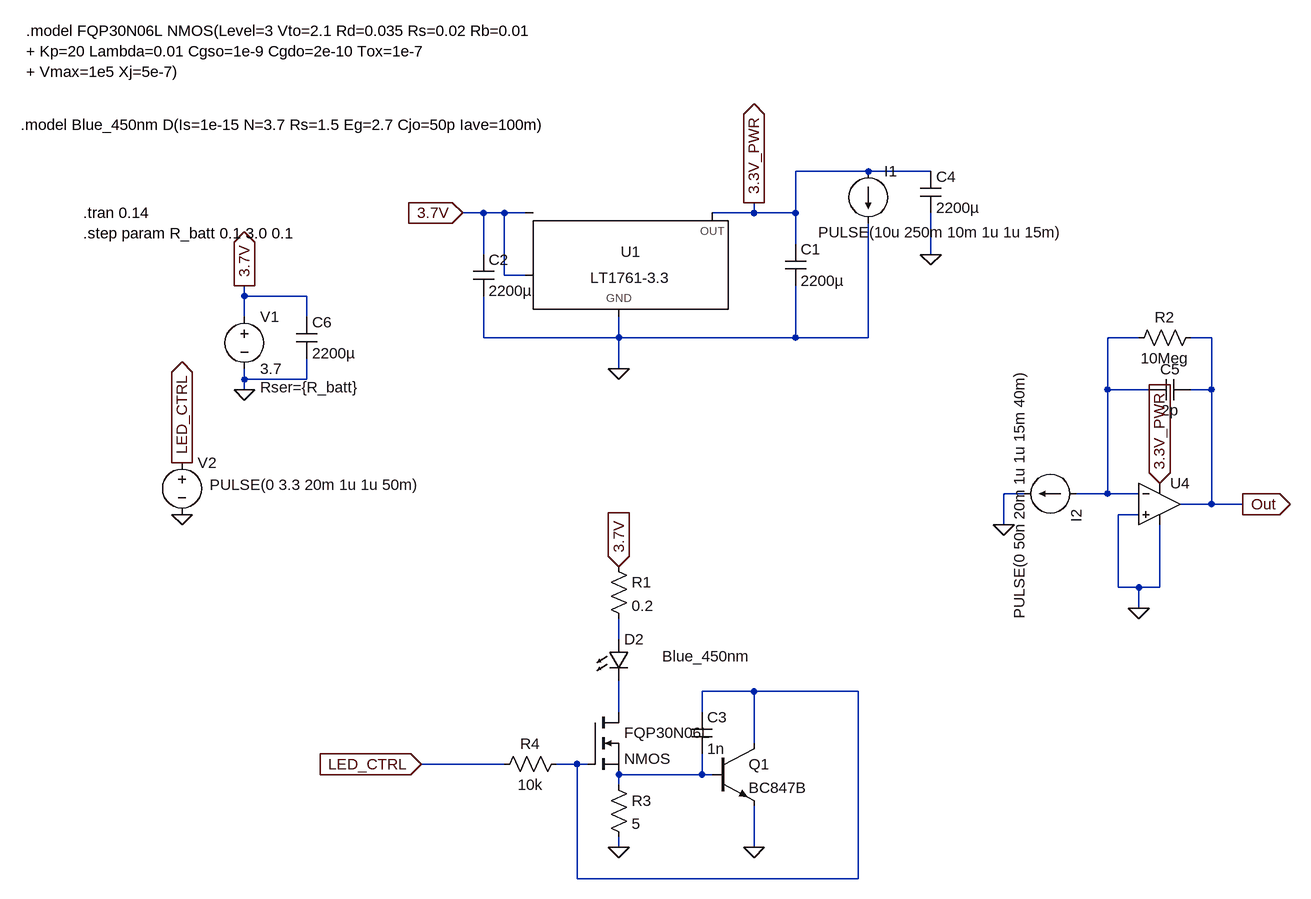
[diagram p0: schematic Draft Power Sim.asc]
Draft Power Sim.asc, the LTspice schematic file:
Version 4.1
SHEET 1 2488 964
WIRE 784 -128 672 -128
WIRE 880 -128 784 -128
WIRE 192 -64 160 -64
WIRE 224 -64 192 -64
WIRE 256 -64 224 -64
WIRE 608 -64 608 -80
WIRE 608 -64 544 -64
WIRE 672 -64 672 -128
WIRE 672 -64 608 -64
WIRE 672 -16 672 -64
WIRE 192 0 192 -64
WIRE 880 0 880 -64
WIRE 224 32 224 -64
WIRE 256 32 224 32
WIRE -176 64 -176 48
WIRE -80 64 -176 64
WIRE -176 96 -176 64
WIRE -80 96 -80 64
WIRE 192 128 192 64
WIRE 400 128 400 96
WIRE 400 128 192 128
WIRE 672 128 672 48
WIRE 672 128 400 128
WIRE 784 128 784 -48
WIRE 784 128 672 128
WIRE 1200 128 1152 128
WIRE 1312 128 1280 128
WIRE 400 176 400 128
WIRE -176 192 -176 176
WIRE -80 192 -80 160
WIRE -80 192 -176 192
WIRE -176 208 -176 192
WIRE 1152 208 1152 128
WIRE 1216 208 1152 208
WIRE 1312 208 1312 128
WIRE 1312 208 1280 208
WIRE 1024 368 992 368
WIRE 1152 368 1152 208
WIRE 1152 368 1104 368
WIRE 1200 368 1152 368
WIRE 1312 384 1312 208
WIRE 1312 384 1264 384
WIRE 1360 384 1312 384
WIRE 1200 400 1168 400
WIRE 992 416 992 368
WIRE 1168 512 1168 400
WIRE 1200 512 1168 512
WIRE 1232 512 1232 416
WIRE 1232 512 1200 512
WIRE 1200 544 1200 512
WIRE 400 592 400 560
WIRE 608 672 528 672
WIRE 768 672 608 672
WIRE 400 704 400 656
WIRE 528 704 528 672
WIRE 608 752 608 672
WIRE 224 784 96 784
WIRE 336 784 304 784
WIRE 352 784 336 784
WIRE 528 800 528 768
WIRE 528 800 400 800
WIRE 544 800 528 800
WIRE 400 816 400 800
WIRE 400 912 400 896
WIRE 608 912 608 848
WIRE 336 960 336 784
WIRE 768 960 768 672
WIRE 768 960 336 960
FLAG -176 208 0
FLAG -176 48 3.7V
IOPIN -176 48 Out
FLAG 160 -64 3.7V
IOPIN 160 -64 In
FLAG -272 400 0
FLAG -272 320 LED_CTRL
IOPIN -272 320 Out
FLAG 96 784 LED_CTRL
IOPIN 96 784 In
FLAG 400 912 0
FLAG 400 176 0
FLAG 880 0 0
FLAG 1200 544 0
FLAG 1232 352 3.3V_PWR
IOPIN 1232 352 In
FLAG 1360 384 Out
IOPIN 1360 384 Out
FLAG 992 416 0
FLAG 608 -80 3.3V_PWR
IOPIN 608 -80 Out
FLAG 400 480 3.7V
IOPIN 400 480 In
FLAG 608 912 0
SYMBOL voltage -176 80 R0
WINDOW 123 0 0 Left 0
WINDOW 39 24 124 Left 2
SYMATTR SpiceLine Rser={R_batt}
SYMATTR InstName V1
SYMATTR Value 3.7
SYMBOL PowerProducts\\LT1761-3.3 400 -16 R0
SYMATTR InstName U1
SYMBOL cap 656 -16 R0
SYMATTR InstName C1
SYMATTR Value 2200µ
SYMBOL cap 176 0 R0
SYMATTR InstName C2
SYMATTR Value 2200µ
SYMBOL current 784 -128 R0
WINDOW 3 -77 94 Left 2
WINDOW 123 0 0 Left 0
WINDOW 39 0 0 Left 0
SYMATTR Value PULSE(10u 250m 10m 1u 1u 15m)
SYMATTR InstName I1
SYMBOL voltage -272 304 R0
WINDOW 3 43 50 Left 2
WINDOW 123 0 0 Left 0
WINDOW 39 0 0 Left 0
SYMATTR Value PULSE(0 3.3 20m 1u 1u 50m)
SYMATTR InstName V2
SYMBOL res 384 464 R0
SYMATTR InstName R1
SYMATTR Value 0.2
SYMBOL LED 384 592 R0
WINDOW 3 83 26 Left 2
SYMATTR Value Blue_450nm
SYMATTR InstName D2
SYMBOL cap 864 -128 R0
SYMATTR InstName C4
SYMATTR Value 2200µ
SYMBOL current 1104 368 R90
WINDOW 3 -192 88 Left 2
WINDOW 123 0 0 Left 0
WINDOW 39 0 0 Left 0
SYMATTR Value PULSE(0 50n 20m 1u 1u 15m 40m)
SYMATTR InstName I2
SYMBOL res 1296 112 R90
WINDOW 0 0 56 VBottom 2
WINDOW 3 32 56 VTop 2
SYMATTR InstName R2
SYMATTR Value 10Meg
SYMBOL cap 1280 192 R90
WINDOW 0 0 32 VBottom 2
WINDOW 3 32 32 VTop 2
SYMATTR InstName C5
SYMATTR Value 2p
SYMBOL cap -96 96 R0
SYMATTR InstName C6
SYMATTR Value 2200µ
SYMBOL npn 544 752 R0
SYMATTR InstName Q1
SYMATTR Value BC847B
SYMBOL res 384 800 R0
SYMATTR InstName R3
SYMATTR Value 5
SYMBOL res 320 768 R90
WINDOW 0 0 56 VBottom 2
WINDOW 3 32 56 VTop 2
SYMATTR InstName R4
SYMATTR Value 10k
SYMBOL cap 512 704 R0
SYMATTR InstName C3
SYMATTR Value 1n
SYMBOL nmos 352 704 R0
SYMATTR InstName FQP30N06L
SYMBOL OpAmps\\UniversalOpAmp2 1232 384 R0
SYMATTR InstName U4
SYMATTR Value2 Avol=1Meg GBW=1Meg Slew=0.6Meg
SYMATTR SpiceLine Ilimit=25m Rail=20m Vos=4.6m
SYMATTR SpiceLine2 En=28n Enk=0 In=0 Ink=0 Rin=1T
TEXT -424 -64 Left 2 !.tran 0.14\n.step param R_batt 0.1 3.0 0.1
TEXT -520 -200 Left 2 !.model Blue_450nm D(Is=1e-15 N=3.7 Rs=1.5 Eg=2.7 Cjo=50p Iave=100m)
TEXT -512 -344 Left 2 !.model FQP30N06L NMOS(Level=3 Vto=2.1 Rd=0.035 Rs=0.02 Rb=0.01 \n+ Kp=20 Lambda=0.01 Cgso=1e-9 Cgdo=2e-10 Tox=1e-7 \n+ Vmax=1e5 Xj=5e-7)

The netlist it stands for:
* Draft Power Sim.asc
V1 3.7V 0 3.7 Rser={R_batt}
X§U1 3.7V 0 3.7V NC_01 3.3V_PWR LT1761-3.3  ; pins ? GND ? BYP OUT
C1 3.3V_PWR 0 2200µ
C2 3.7V 0 2200µ
I1 3.3V_PWR 0 PULSE(10u 250m 10m 1u 1u 15m)
V2 LED_CTRL 0 PULSE(0 3.3 20m 1u 1u 50m)
R1 3.7V N002 0.2
D2 N002 N004 Blue_450nm
C4 3.3V_PWR 0 2200µ
I2 N001 0 PULSE(0 50n 20m 1u 1u 15m 40m)
R2 Out N001 10Meg
C5 Out N001 2p
C6 3.7V 0 2200µ
Q1 N003 N005 0 0 BC847B
R3 N005 0 5
R4 N003 LED_CTRL 10k
C3 N003 N005 1n
M§FQP30N06L N004 N003 N005 N005 NMOS
X§U4 0 N001 3.3V_PWR 0 Out level2 Avol=1Meg GBW=1Meg Slew=0.6Meg Ilimit=25m Rail=20m Vos=4.6m En=28n Enk=0 In=0 Ink=0 Rin=1T  ; pins In+ In- V+ V- OUT
.model D D
.lib standard.dio
.model NPN NPN
.model PNP PNP
.lib standard.bjt
.model NMOS NMOS
.model PMOS PMOS
.lib standard.mos
.tran 0.14
.step param R_batt 0.1 3.0 0.1
.model Blue_450nm D(Is=1e-15 N=3.7 Rs=1.5 Eg=2.7 Cjo=50p Iave=100m)
.model FQP30N06L NMOS(Level=3 Vto=2.1 Rd=0.035 Rs=0.02 Rb=0.01
+ Kp=20 Lambda=0.01 Cgso=1e-9 Cgdo=2e-10 Tox=1e-7
+ Vmax=1e5 Xj=5e-7)
.lib UniversalOpAmp2.lib
.backanno
.end